# Altium schematic sheet DIFF_DELAY_FANOUT.SchDoc: SPEC-A7
size 420 x 297 mm; Author: G.Kasprowicz; CompanyName: WUT ISE; DrawnBy: G.Kasprowicz; Organization: WUT ISE; Address1: PW ISE; Address2: Nowowiejska 15/19 00-665 Warsaw; Address3: gkasprow@gmail.com; Revision: 2; SheetNumber: 11; SheetTotal: 18; ModifiedBy: -; CheckedDate: -; Title2: Delay & outputs; DivGrp: WUT ISE; Designer: G.Kasprowicz; ModifiedDate: -; ProjectName: Sensor Box
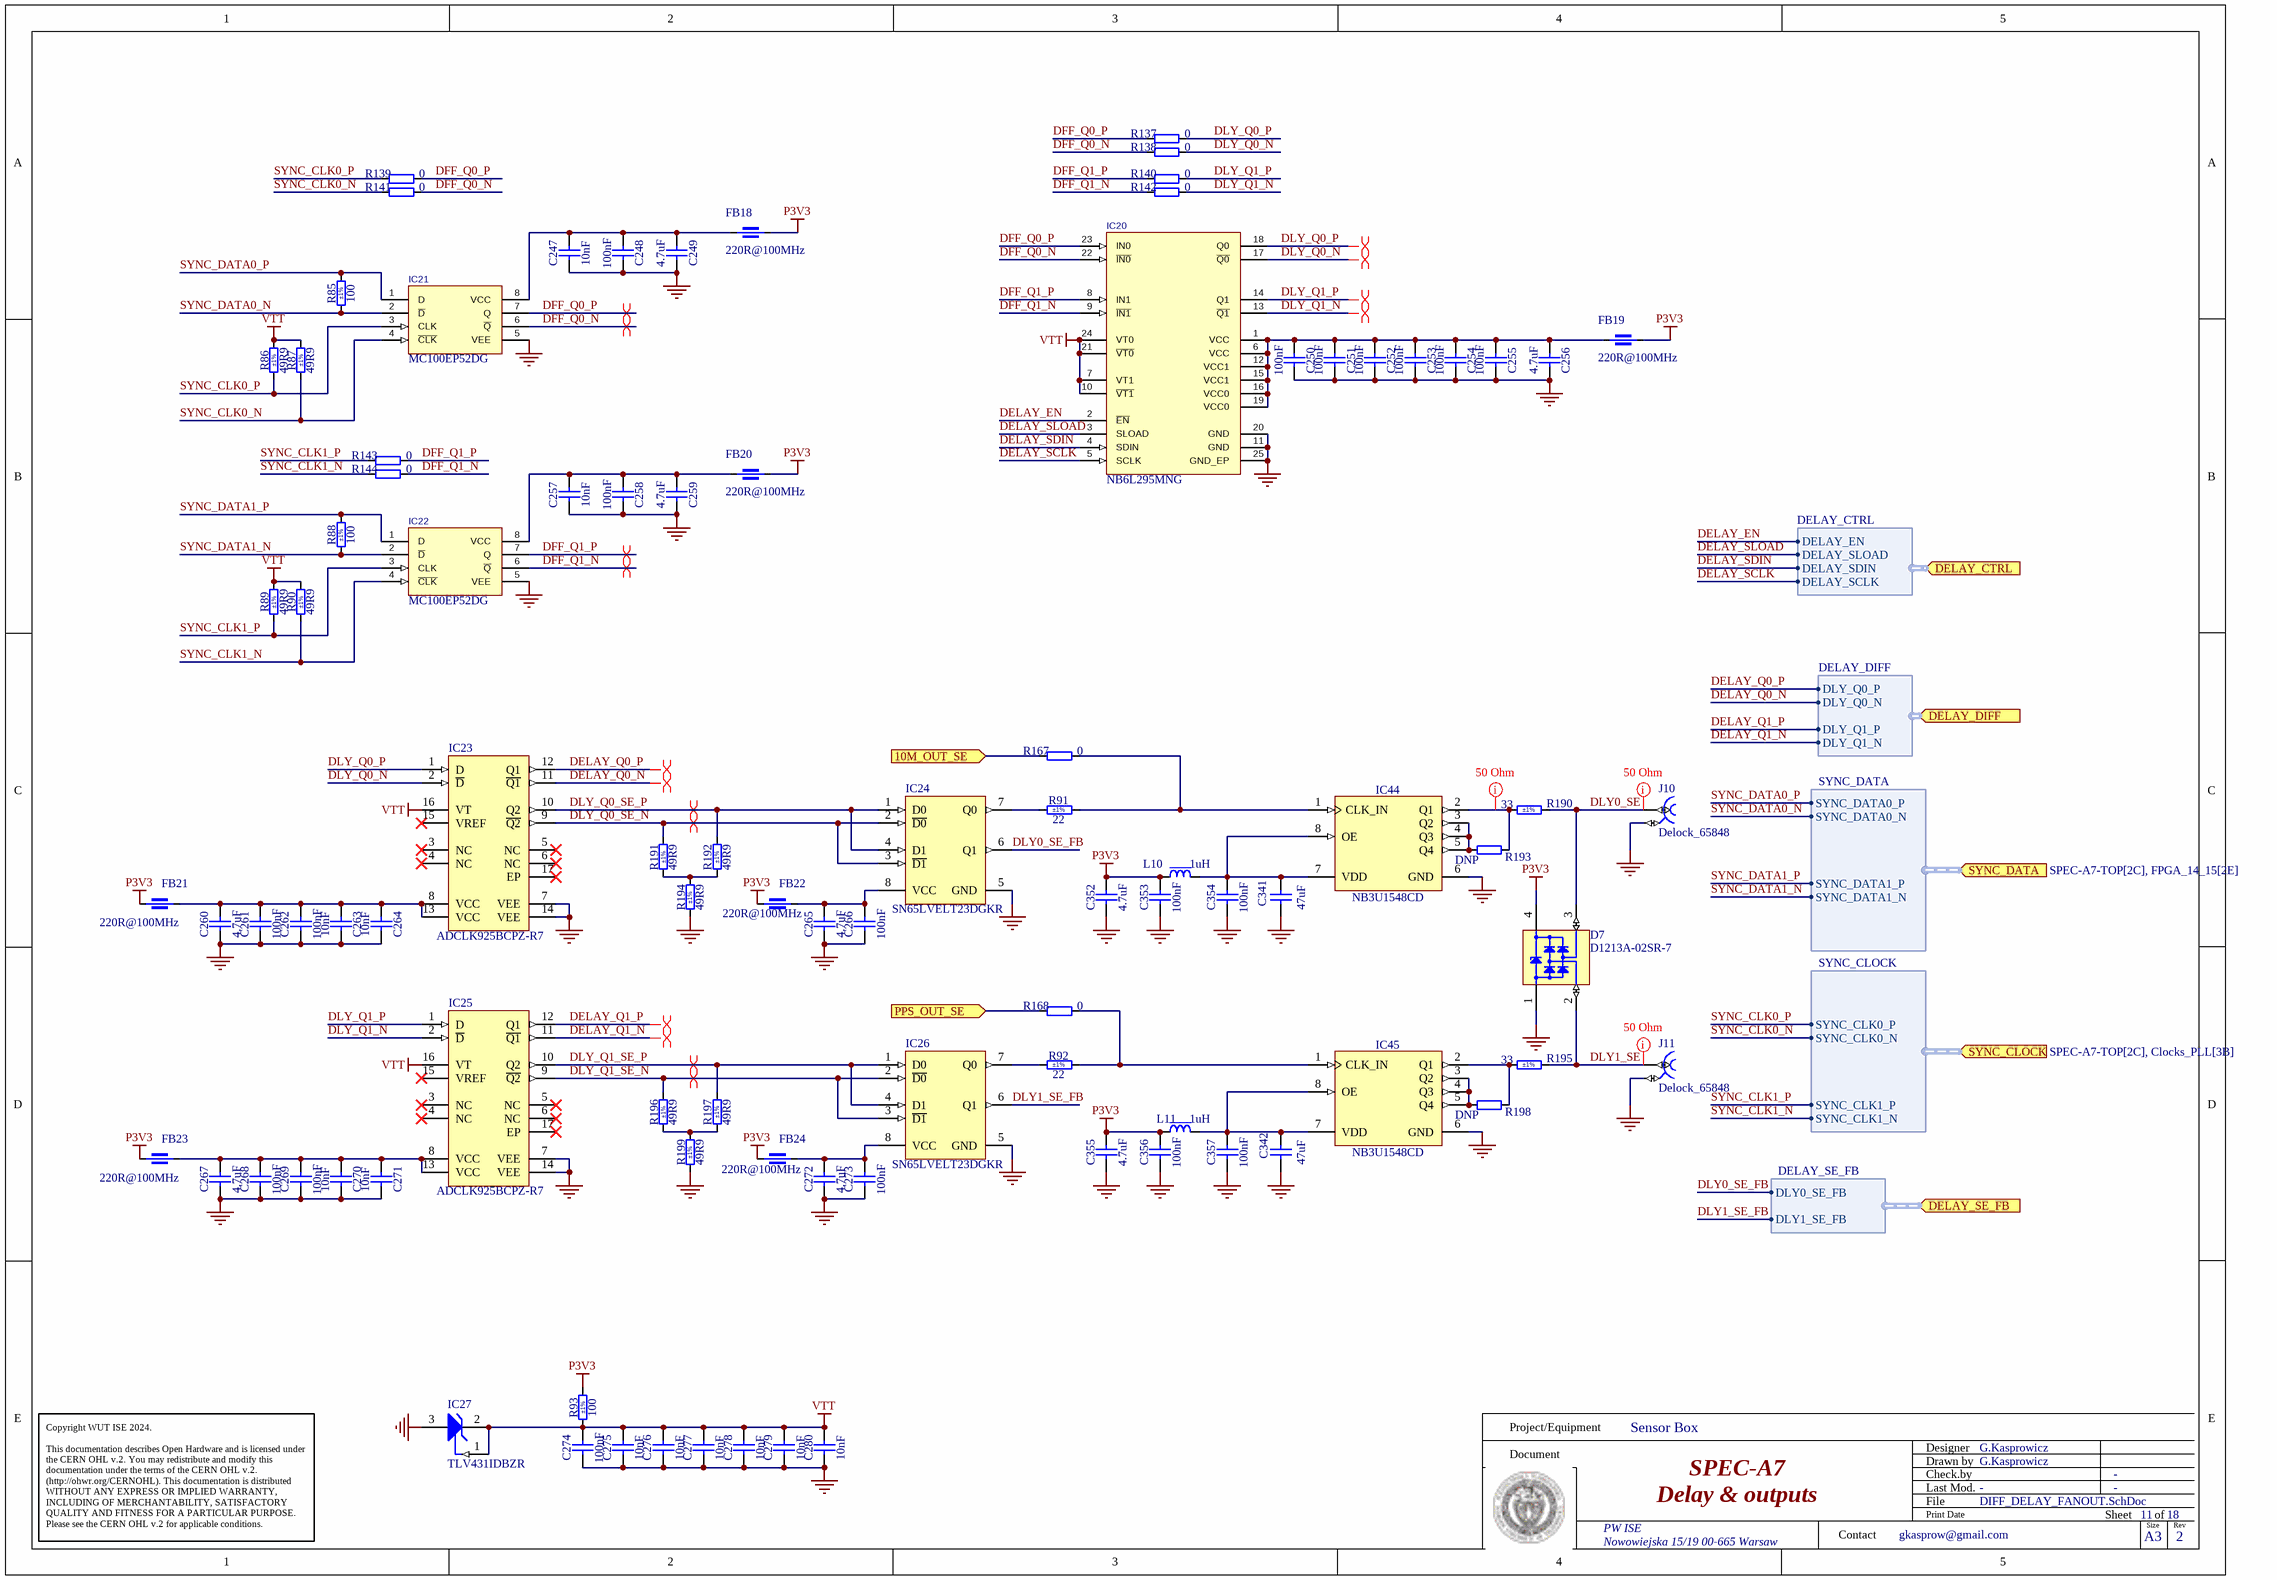
[diagram p0: DIFF_DELAY_FANOUT.SchDoc]

## Parts
C247  10nF  [CAPC1005X55N]
C248  100nF  [CAPC0603X33N]
C249  4.7uF  [CAPC1005X55N]
C250  100nF  [CAPC0603X33N]
C251  100nF  [CAPC0603X33N]
C252  100nF  [CAPC0603X33N]
C253  100nF  [CAPC0603X33N]
C254  100nF  [CAPC0603X33N]
C255  100nF  [CAPC0603X33N]
C256  4.7uF  [CAPC1005X55N]
C257  10nF  [CAPC1005X55N]
C258  100nF  [CAPC0603X33N]
C259  4.7uF  [CAPC1005X55N]
C260  4.7uF  [CAPC1005X55N]
C261  100nF  [CAPC0603X33N]
C262  100nF  [CAPC0603X33N]
C263  10nF  [CAPC1005X55N]
C264  10nF  [CAPC1005X55N]
C265  4.7uF  [CAPC1005X55N]
C266  100nF  [CAPC0603X33N]
C267  4.7uF  [CAPC1005X55N]
C268  100nF  [CAPC0603X33N]
C269  100nF  [CAPC0603X33N]
C270  10nF  [CAPC1005X55N]
C271  10nF  [CAPC1005X55N]
C272  4.7uF  [CAPC1005X55N]
C273  100nF  [CAPC0603X33N]
C274  100nF  [CAPC0603X33N]
C275  10nF  [CAPC1005X55N]
C276  10nF  [CAPC1005X55N]
C277  10nF  [CAPC1005X55N]
C278  10nF  [CAPC1005X55N]
C279  10nF  [CAPC1005X55N]
C280  10nF  [CAPC1005X55N]
C341  47uF  [CAPC1608X100N]
C342  47uF  [CAPC1608X100N]
C352  4.7uF  [CAPC1005X55N]
C353  100nF  [CAPC0603X33N]
C354  100nF  [CAPC0603X33N]
C355  4.7uF  [CAPC1005X55N]
C356  100nF  [CAPC0603X33N]
C357  100nF  [CAPC0603X33N]
D7  D1213A-02SR-7  [SOT190P238X100-4N]
FB18  220R@100MHz  [INDC1608X95N]
FB19  220R@100MHz  [INDC1608X95N]
FB20  220R@100MHz  [INDC1608X95N]
FB21  220R@100MHz  [INDC1608X95N]
FB22  220R@100MHz  [INDC1608X95N]
FB23  220R@100MHz  [INDC1608X95N]
FB24  220R@100MHz  [INDC1608X95N]
IC20  NB6L295MNG  [QFN50P400X400X80-25N-S280]
IC21  MC100EP52DG  [SOIC127P600X175-8N]
IC22  MC100EP52DG  [SOIC127P600X175-8N]
IC23  ADCLK925BCPZ-R7  [ADI-CP-16-3_L]
IC24  SN65LVELT23DGKR  [DGK0008A_L]
IC25  ADCLK925BCPZ-R7  [ADI-CP-16-3_L]
IC26  SN65LVELT23DGKR  [DGK0008A_L]
IC27  TLV431IDBZR  [DBZ0003A_N]
IC44  NB3U1548CD  [SOIC127P600X175-8N]
IC45  NB3U1548CD  [SOIC127P600X175-8N]
J10  Delock_65848  [Delock_65848]
J11  Delock_65848  [Delock_65848]
L10  1uH  [IND_MURATA_LQH32C]
L11  1uH  [IND_MURATA_LQH32C]
R85  100  Tolerance: ±1%  [RESC1005X40N]
R86  49R9  Tolerance: ±1%  [RESC1005X40N]
R87  49R9  Tolerance: ±1%  [RESC1005X40N]
R88  100  Tolerance: ±1%  [RESC1005X40N]
R89  49R9  Tolerance: ±1%  [RESC1005X40N]
R90  49R9  Tolerance: ±1%  [RESC1005X40N]
R91  22  Tolerance: ±1%  [RESC1005X40N]
R92  22  Tolerance: ±1%  [RESC1005X40N]
R93  100  Tolerance: ±1%  [RESC1005X40N]
R137  0  [RESC1005X40N]  (no BOM)
R138  0  [RESC1005X40N]  (no BOM)
R139  0  [RESC1005X40N]  (no BOM)
R140  0  [RESC1005X40N]  (no BOM)
R141  0  [RESC1005X40N]  (no BOM)
R142  0  [RESC1005X40N]  (no BOM)
R143  0  [RESC1005X40N]  (no BOM)
R144  0  [RESC1005X40N]  (no BOM)
R167  0  [RESC1005X40N]  (no BOM)
R168  0  [RESC1005X40N]  (no BOM)
R190  33  Tolerance: ±1%  [RESC2012X60N]
R191  49R9  Tolerance: ±1%  [RESC1005X40N]
R192  49R9  Tolerance: ±1%  [RESC1005X40N]
R193  DNP  [RESC1005X40N]  (no BOM)
R194  49R9  Tolerance: ±1%  [RESC1005X40N]
R195  33  Tolerance: ±1%  [RESC2012X60N]
R196  49R9  Tolerance: ±1%  [RESC1005X40N]
R197  49R9  Tolerance: ±1%  [RESC1005X40N]
R198  DNP  [RESC1005X40N]  (no BOM)
R199  49R9  Tolerance: ±1%  [RESC1005X40N]

## Ports
10M_OUT_SE (in, see SPEC-A7-TOP[2C], FPGA_34[2C]), DELAY_CTRL (in, harness DELAY_CTRL, see SPEC-A7-TOP[2C], FPGA_14_15[1D]), DELAY_DIFF (in, harness DELAY_DIFF, see SPEC-A7-TOP[2C], Ext_connectors[2C]), DELAY_SE_FB (in, harness DELAY_SE_FB, see SPEC-A7-TOP[2C], FPGA_14_15[2E]), PPS_OUT_SE (in, see SPEC-A7-TOP[2C], FPGA_34[2C]), SYNC_CLOCK (in, harness SYNC_CLOCK, see SPEC-A7-TOP[2C], Clocks_PLL[3B]), SYNC_DATA (in, harness SYNC_DATA, see SPEC-A7-TOP[2C], FPGA_14_15[2E])

## Harnesses
SYNC_DATA: SYNC_DATA0_P, SYNC_DATA0_N, SYNC_DATA1_P, SYNC_DATA1_N
DELAY_DIFF: DLY_Q0_P, DLY_Q0_N, DLY_Q1_P, DLY_Q1_N
DELAY_CTRL: DELAY_EN, DELAY_SLOAD, DELAY_SDIN, DELAY_SCLK
DELAY_SE_FB: DLY0_SE_FB, DLY1_SE_FB
SYNC_CLOCK: SYNC_CLK0_P, SYNC_CLK0_N, SYNC_CLK1_P, SYNC_CLK1_N

## Nets
GND: C247.1 C248.1 C249.1 C250.1 C251.1 C252.1 C253.1 C254.1 C255.1 C256.1 C257.1 C258.1 C259.1 C260.1 C261.1 C262.1 C263.1 C264.1 C265.1 C266.1 C267.1 C268.1 C269.1 C270.1 C271.1 C272.1 C273.1 C274.1 C275.1 C276.1 C277.1 C278.1 C279.1 C280.1 C341.1 C342.1 C352.1 C353.1 C354.1 C355.1 C356.1 C357.1 D7.1(GND) IC20.11(GND) IC20.20(GND) IC20.25(GND_EP) IC21.5(VEE) IC22.5(VEE) IC23.7(VEE) IC23.14(VEE) IC24.5(GND) IC25.7(VEE) IC25.14(VEE) IC26.5(GND) IC27.3(ANODE) IC44.6(GND) IC45.6(GND) J10.2 J11.2 R194.1 R199.1
P3V3: C352.2 C353.2 C355.2 C356.2 D7.4(VCC) FB18.1 FB19.1 FB20.1 FB21.1 FB22.1 FB23.1 FB24.1 L10.1 L11.1 R93.2
VTT: C274.2 C275.2 C276.2 C277.2 C278.2 C279.2 C280.2 IC20.7(VT1) IC20.10(~{VT1}) IC20.21(~{VT0}) IC20.24(VT0) IC23.16(VT) IC25.16(VT) IC27.1(REF) IC27.2(CATHODE) R86.2 R87.2 R89.2 R90.2 R93.1
10M_OUT_SE: R167.1 ; port 10M_OUT_SE
DELAY_EN: IC20.2(~{EN}) ; port DELAY_CTRL.DELAY_EN
DELAY_Q0_N: IC23.11(~{Q1}) ; port DELAY_DIFF.DLY_Q0_N
DELAY_Q0_P: IC23.12(Q1) ; port DELAY_DIFF.DLY_Q0_P
DELAY_Q1_N: IC25.11(~{Q1}) ; port DELAY_DIFF.DLY_Q1_N
DELAY_Q1_P: IC25.12(Q1) ; port DELAY_DIFF.DLY_Q1_P
DELAY_SCLK: IC20.5(SCLK) ; port DELAY_CTRL.DELAY_SCLK
DELAY_SDIN: IC20.4(SDIN) ; port DELAY_CTRL.DELAY_SDIN
DELAY_SLOAD: IC20.3(SLOAD) ; port DELAY_CTRL.DELAY_SLOAD
DFF_Q0_N: IC20.22(~{IN0}) IC21.6(~{Q}) R138.1 R141.2
DFF_Q0_P: IC20.23(IN0) IC21.7(Q) R137.1 R139.2
DFF_Q1_N: IC20.9(~{IN1}) IC22.6(~{Q}) R142.1 R144.2
DFF_Q1_P: IC20.8(IN1) IC22.7(Q) R140.1 R143.2
DLY0_SE: D7.3(I/O2) J10.1 R190.1
DLY0_SE_FB: IC24.6(Q1) ; port DELAY_SE_FB.DLY0_SE_FB
DLY1_SE: D7.2(I/O1) J11.1 R195.1
DLY1_SE_FB: IC26.6(Q1) ; port DELAY_SE_FB.DLY1_SE_FB
DLY_Q0_N: IC20.17(~{Q0}) IC23.2(~{D}) R138.2
DLY_Q0_P: IC20.18(Q0) IC23.1(D) R137.2
DLY_Q0_SE_N: IC23.9(~{Q2}) IC24.2(~{D0}) IC24.3(~{D1}) R191.2
DLY_Q0_SE_P: IC23.10(Q2) IC24.1(D0) IC24.4(D1) R192.2
DLY_Q1_N: IC20.13(~{Q1}) IC25.2(~{D}) R142.2
DLY_Q1_P: IC20.14(Q1) IC25.1(D) R140.2
DLY_Q1_SE_N: IC25.9(~{Q2}) IC26.2(~{D0}) IC26.3(~{D1}) R196.2
DLY_Q1_SE_P: IC25.10(Q2) IC26.1(D0) IC26.4(D1) R197.2
PPS_OUT_SE: R168.1 ; port PPS_OUT_SE
SYNC_CLK0_N: IC21.4(~{CLK}) R87.1 R141.1 ; port SYNC_CLOCK.SYNC_CLK0_N
SYNC_CLK0_P: IC21.3(CLK) R86.1 R139.1 ; port SYNC_CLOCK.SYNC_CLK0_P
SYNC_CLK1_N: IC22.4(~{CLK}) R90.1 R144.1 ; port SYNC_CLOCK.SYNC_CLK1_N
SYNC_CLK1_P: IC22.3(CLK) R89.1 R143.1 ; port SYNC_CLOCK.SYNC_CLK1_P
SYNC_DATA0_N: IC21.2(~{D}) R85.1 ; port SYNC_DATA.SYNC_DATA0_N
SYNC_DATA0_P: IC21.1(D) R85.2 ; port SYNC_DATA.SYNC_DATA0_P
SYNC_DATA1_N: IC22.2(~{D}) R88.1 ; port SYNC_DATA.SYNC_DATA1_N
SYNC_DATA1_P: IC22.1(D) R88.2 ; port SYNC_DATA.SYNC_DATA1_P
NetC247_2: C247.2 C248.2 C249.2 FB18.2 IC21.8(VCC)
NetC250_2: C250.2 C251.2 C252.2 C253.2 C254.2 C255.2 C256.2 FB19.2 IC20.1(VCC) IC20.6(VCC) IC20.12(VCC1) IC20.15(VCC1) IC20.16(VCC0) IC20.19(VCC0)
NetC257_2: C257.2 C258.2 C259.2 FB20.2 IC22.8(VCC)
NetC260_2: C260.2 C261.2 C262.2 C263.2 C264.2 FB21.2 IC23.8(VCC) IC23.13(VCC)
NetC265_2: C265.2 C266.2 FB22.2 IC24.8(VCC)
NetC267_2: C267.2 C268.2 C269.2 C270.2 C271.2 FB23.2 IC25.8(VCC) IC25.13(VCC)
NetC272_2: C272.2 C273.2 FB24.2 IC26.8(VCC)
NetC341_2: C341.2 C354.2 IC44.7(VDD) IC44.8(OE) L10.2
NetC342_2: C342.2 C357.2 IC45.7(VDD) IC45.8(OE) L11.2
NetIC24_7: IC24.7(Q0) R91.1
NetIC26_7: IC26.7(Q0) R92.1
NetIC44_1: IC44.1(CLK_IN) R91.2 R167.2
NetIC44_2: IC44.2(Q1) R190.2 R193.1
NetIC44_3: IC44.3(Q2) IC44.4(Q3) IC44.5(Q4) R193.2
NetIC45_1: IC45.1(CLK_IN) R92.2 R168.2
NetIC45_2: IC45.2(Q1) R195.2 R198.1
NetIC45_3: IC45.3(Q2) IC45.4(Q3) IC45.5(Q4) R198.2
NetR191_1: R191.1 R192.1 R194.2
NetR196_1: R196.1 R197.1 R199.2

Not connected (* = marked no-connect by the designer): IC23 3(NC)* 4(NC)* 5(NC)* 6(NC)* 15(VREF)* 17(EP)*; IC25 3(NC)* 4(NC)* 5(NC)* 6(NC)* 15(VREF)* 17(EP)*

## Layout directives
differential pair: DELAY_Q0_N, DELAY_Q0_P, DELAY_Q1_N, DELAY_Q1_P, DFF_Q0_N, DFF_Q0_P, DFF_Q1_N, DFF_Q1_P, DLY_Q0_N, DLY_Q0_P, DLY_Q0_SE_N, DLY_Q0_SE_P, DLY_Q1_N, DLY_Q1_P, DLY_Q1_SE_N, DLY_Q1_SE_P
net class 50_Ohm: DLY0_SE, DLY1_SE, NetIC44_2

## Notes on the sheet
- Project/Equipment
- Document
- Designer
- Drawn by
- Check.by
- Copyright WUT ISE 2024.
  This documentation describes Open Hardware and is licensed under the CERN OHL v.2. You may redistribute and modify this documentation under the terms of the CERN OHL v.2. (http://ohwr.org/CERNOHL). This documentation is distributed WITHOUT ANY EXPRESS OR IMPLIED WARRANTY, INCLUDING OF MERCHANTABILITY, SATISFACTORY QUALITY AND FITNESS FOR A PARTICULAR PURPOSE. Please see the CERN OHL v.2 for applicable conditions.
- Contact
- File
- Last Mod.
- Print Date
- Sheet
- Size
- A3
- of
- Rev

## Library data of the parts
C247 C257 C263 C264 C270 C271 C275-C280 = CC0402_10NF_16V_10%_X7R: Non-polarised capacitor; Part Description: SMD Multilayer Chip Ceramic Capacitor; Manufacturer: GENERIC; Manufacturer1 Part Number: 223878715636; Voltage: 16V; TC: X7R; Tolerance: ±10%; Part Number: CC0402_10NF_16V_10%_X7R; Component Kind: Standard; Component Type: Standard; Pin Count: 2; Value: 10nF; Status: Not Recommended; Manufacturer Part Number: CC0402_10NF_16V_10%_X7R; Case: 0402; Mounted: Yes; Socket: No; SMD: Yes; Sense: No; Manufacturer1 Example: PHYCOMP; Manufacturer1 ComponentHeight: 0.55mm; HelpURL: \\cern.ch\dfs\Applications\Altium\Datasheets\CC0402_X7R_PHYCOMP.pdf; Author: CERN DEM JLC; CreateDate: 03.12.2007; LatestRevisionDate: 03.12.2007
C248 C250-C255 C258 C261 C262 C266 C268 C269 C273 C274 C353 C354 C356 C357 = CC0201_100NF_6.3V_10%_X5R: Non-polarised capacitor; Part Description: SMD Multilayer Chip Ceramic Capacitor; Manufacturer: GENERIC; Manufacturer1 Part Number: 02016D104KAT2A; Voltage: 6.3V; TC: X5R; Tolerance: ±10%; Part Number: CC0201_100NF_6.3V_10%_X5R; Component Kind: Standard; Component Type: Standard; Pin Count: 2; Value: 100nF; Status: Not Recommended; Manufacturer Part Number: CC0201_100NF_6.3V_10%_X5R; Case: 0201; Mounted: Yes; Socket: No; SMD: Yes; Sense: No; Manufacturer1 Example: AVX; Manufacturer1 ComponentHeight: 0.33mm; HelpURL: \\cern.ch\dfs\Applications\Altium\Datasheets\CC0201_X5R_AVX.pdf; Author: CERN DEM JLC; CreateDate: 03.12.2007; LatestRevisionDate: 03.12.2007
C249 C256 C259 C260 C265 C267 C272 C352 C355 = CC0402_4.7UF_6.3V_20%_X5R: Non-polarised capacitor; Part Description: SMD Multilayer Chip Ceramic Capacitor; Manufacturer: GENERIC; Manufacturer1 Part Number: C1005X5R0J475M050BC; Voltage: 6.3V; TC: X5R; Tolerance: ±20%; Part Number: CC0402_4.7UF_6.3V_20%_X5R; Component Kind: Standard; Component Type: Standard; Pin Count: 2; Value: 4.7uF; Status: Preferred; Manufacturer Part Number: CC0402_4.7UF_6.3V_20%_X5R; Case: 0402; Mounted: Yes; Socket: No; SMD: Yes; Sense: No; Manufacturer1 Example: TDK; Manufacturer1 ComponentHeight: 0.65mm; HelpURL: \\cern.ch\dfs\Applications\Altium\Datasheets\CC0402_X5R_TDK_C.pdf; Author: CERN DEM JLC; CreateDate: 03.03.2015; LatestRevisionDate: 03.03.2015
C341 C342 = CC0603_47UF_6.3V_20%_X5R: Non-polarised capacitor; Part Description: SMD Multilayer Chip Ceramic Capacitor; Manufacturer: GENERIC; Manufacturer1 Part Number: GRM188R60J476ME15D; Voltage: 6.3V; TC: X5R; Tolerance: ±20%; Part Number: CC0603_47UF_6.3V_20%_X5R; Component Kind: Standard; Component Type: Standard; Pin Count: 2; Value: 47uF; Status: None; Manufacturer Part Number: CC0603_47UF_6.3V_20%_X5R; Case: 0603; Mounted: Yes; Socket: No; SMD: Yes; Sense: No; Manufacturer1 Example: MURATA; Manufacturer1 ComponentHeight: 1mm; HelpURL: \\cern.ch\dfs\Applications\Altium\Datasheets\CC0603_MURATA_GRM188R60J476ME15D.pdf; Author: CERN DEM JLC; CreateDate: 01.02.2018; LatestRevisionDate: 01.02.2018
D7 = CMP-004-00039-1: D1213A-02SR Series 400 mW Uni-Directional Surface Mount TVS Diode - SOT-143; Mounting Technology: Surface Mount; Case/Package: SOT-143; Max Operating Temperature: 150°C; Pins: 4; Min Operating Temperature: -65°C
FB18-FB24 = IND0603_MURATA_BLM18SG221TN1: Part Description: SMD EMIFIL Suppression Chip Ferrite Bead; Manufacturer: MURATA; Tolerance: ±25%; Power: 2.5A; Resistance: 0.04R; Part Number: IND0603_MURATA_BLM18SG221TN1; Component Kind: Standard; Component Type: Standard; Pin Count: 2; Value: 220R@100MHz; Manufacturer Part Number: BLM18SG221TN1; Case: 0603; Mounted: Yes; Socket: No; SMD: Yes; Sense: No; ComponentHeight: 0.95mm; HelpURL: \\cern.ch\dfs\Applications\Altium\Datasheets\IND0603_MURATA_BLM18S.pdf; Author: CERN DEM MR; CreateDate: 08.01.2016; LatestRevisionDate: 25.10.2018
IC20 = NB6L295MNG: Manufacturer_Name: onsemi; Reference: IC?; Footprint: QFN50P400X400X100-25N; Datasheet: http://www.onsemi.com/pub/Collateral/NB6L295-D.PDF; Height: 1; Mouser Part Number: 863-NB6L295MNG; Mouser Price/Stock: https://www.mouser.co.uk/ProductDetail/ON-Semiconductor/NB6L295MNG?qs=t2BMfLoP1KTcOfiCXyq1Jw%3D%3D; Manufacturer_Part_Number: NB6L295MNG; Value: NB6L295MNG
IC21 IC22 = MC100EP52DG: Manufacturer_Name: onsemi; Reference: IC; Datasheet: http://www.onsemi.com/pub/Collateral/MC10EP52-D.PDF; Height: 1.75; Mouser Part Number: 863-MC100EP52DG; Mouser Price/Stock: https://www.mouser.co.uk/ProductDetail/onsemi/MC100EP52DG?qs=zorda86t5M%2FLiRmjo16XeQ%3D%3D; Manufacturer_Part_Number: MC100EP52DG; Value: MC100EP52DG
IC23 IC25 = CMP-0288-00092-1: Ultrafast SiGe ECL Clock/Data Buffers, CP-16-3, Pb-Free, 1500 Reel; Inputs: 1; Product Description: Clock Buffer; Outputs: 2; Max f-out (MHz): 6000; +Supply Voltage (V): 3.3; On-Chip VCO or DCO: No; Output Logic: ECL; LVPECL; PECL; ComponentLink1URL: www.analog.com; DatasheetVersion: Rev. 0; Code_JEDEC: MO-220-VEED-2; ComponentLink3Description: Package Specification; PackageDescription: 16-Lead Lead Frame Chip Scale Package [LFCSP_VQ]; ComponentLink3URL: http://www.analog.com/static/imported-files/packages/PKG_PDF/LFCSP(CP)/CP_16_3.pdf; PackageReference: CP-16-3; PackageVersion: Jan-2005; ComponentLink1Description: Manufacturer URL; ComponentLink2URL: http://www.analog.com/static/imported-files/data_sheets/ADCLK905_907_925.pdf; ComponentLink2Description: Datasheet
IC24 IC26 = CMP-0327-00201-3: 600 Mbps 3.3 V Dual Differential LVPECL Buffer to LVTTL Translator, 2 Tx and 2 Rx, -40 to +85 degC, 8-pin VSSOP (DGK), Green (RoHS & no Sb/Br); Manufacturer: Texas Instruments; Part-to-Part Skew(Max)(ps): 200; ICC(Max)(mA): 27; No. of Tx: 2; SubFamily: PECL PHY; xECL: TRUE; Signaling Rate(Mbps): 600; Input Signal: LVPECL, LVDS; ComponentLink3Description: URL Link1; PartNumber: SN65LVELT23DGKR; PackageVersion: revE, May-2006; No. of Rx: 2; ComponentLink1Description: Manufacturer URL; ComponentLink2Description: Datasheet; ComponentLink1URL: http://www.ti.com/; PackageDescription: 8-Pin Thin Small Outline Package 3 x 3 mm Body ,0.65 mm Pitch; DatasheetVersion: SLLS929A; PackageReference: DGK0008A; Eco-Plan: Green (RoHS & no Sb/Br); Output Signal: LVTTL; ComponentLink3URL: SamplesURL:http://www.ti.com/product/sn65lvelt23#samples; ComponentLink2URL: http://www.ti.com/general/docs/lit/getliterature.tsp?genericPartNumber=SN65LVELT23&fileType=pdf; Mounting Technology: Surface Mount
IC27 = CMP-0366-00832-2: Low Voltage Adjustable Precision Shunt Regulator, 39 ppm / degC, 15 mA, -40 to 85 degC, 3-pin SOT-23 (DBZ), Green (RoHS & no Sb/Br); Manufacturer: Texas Instruments; VO Adj(Min)(V): 1.24; Temp Coeff(Typ)(ppm/ degree C): 39; Rating: Catalog; Min Iz for Regulation(uA): 80; VO Adj(Max)(V): 6; Iout/Iz(Max)(mA): 15; Temp Coeff(Max)(ppm/ degree C): 129; SubFamily: Shunt Voltage Reference; Initial Accuracy @ 25/deg C(%): 1.5; Eco-Plan: Green (RoHS & no Sb/Br); PackageDescription: 3-Pin Plastic Small Outline, Body 2.92 x 1.3 mm, Pitch 0.95 mm; PackageReference: DBZ0003A; ComponentLink4Description: URL Link1; ComponentLink3Description: Package Specification; DatasheetVersion: SLVS139T; ComponentLink4URL: Samples URL:http://www.ti.com/product/tlv431; PackageVersion: 4203227/B; ComponentLink3URL: http://www.ti.com/litv/pdf/mpds108a; ComponentLink1URL: http://www.ti.com/; Code_JEDEC: TO-236; ComponentLink2Description: Datasheet; ComponentLink1Description: Manufacturer URL; Mounting Technology: Surface Mount; PartNumber: TLV431IDBZR; ComponentLink2URL: http://www.ti.com/general/docs/lit/getliterature.tsp?genericPartNumber=TLV431&fileType=pdf
IC44 IC45 = NB3U1548CD: 3.3V/2.5V/1.8V/1.5V 160 MHz 1:4 LVCMOS/LVTTL Low Skew Over Voltage Tolerant Fanout Buffer; Manufacturer: ON SEMICONDUCTOR; PressFit: No; Bonding: No; Part Number: NB3U1548CD; Component Kind: Standard; Component Type: Standard; Device: NB3U1548CD; PackageDescription: SOIC 8, Pitch 1.27mm, Body 4x5mm, IPC Medium Density; Part Description: 3.3V/2.5V/1.8V/1.5V 160 MHz 1:4 LVCMOS/LVTTL Low Skew Over Voltage Tolerant Fanout Buffer; Manufacturer Part Number: NB3U1548CD; Pin Count: 8; Case: SOIC8; Mounted: Yes; Socket: No; SMD: Yes; Sense: No; ComponentHeight: 1.75mm; Author: CERN DEM HF; HelpURL: \\cern.ch\dfs\Applications\Altium\Datasheets\NB3U1548C.pdf; CreateDate: 29.11.2024; LatestRevisionDate: 29.11.2024
J10 J11 = CMP-002-04652-1: SMA connector Delock 65848
L10 L11 = IND_1UH_20%_MURATA_LQH32CN1R0M33: Inductor With Core; Part Description: Chip Inductor (Chip Coil) for Choke Wire Wound Type; Manufacturer: MURATA; Power: 1A; Resistance: 0.06R; Tolerance: ±20%; Part Number: IND_1UH_20%_MURATA_LQH32CN1R0M33; Component Kind: Standard; Component Type: Standard; Pin Count: 2; Value: 1uH; Manufacturer Part Number: LQH32CN1R0M33; Mounted: Yes; Socket: No; SMD: Yes; Sense: No; ComponentHeight: 2.2mm; HelpURL: \\cern.ch\dfs\Applications\Altium\Datasheets\IND_MURATA_LQH32CN_33.pdf; Author: CERN DEM JLC; CreateDate: 14.08.2012; LatestRevisionDate: 04.07.2018
R85 R88 R93 = R0402_100R_1%_0.0625W_100PPM: Resistor - 1%; Part Description: General Purpose Thick Film Chip Resistor; Manufacturer: GENERIC; Manufacturer1 Part Number: 232270671001L; TC: ±100ppm/°C; PressFit: No; Part Number: R0402_100R_1%_0.0625W_100PPM; Component Kind: Standard; Component Type: Standard; Pin Count: 2; Value: 100; Status: Not Recommended; Power: 0.0625W; Manufacturer Part Number: R0402_100R_1%_0.0625W_100PPM; Case: 0402; Mounted: Yes; Sense: No; Socket: No; SMD: Yes; Manufacturer1 Example: YAGEO PHYCOMP; Manufacturer1 ComponentHeight: 0.4mm; HelpURL: \\cern.ch\dfs\Applications\Altium\Datasheets\R0402_Phycomp_RC0402.pdf; Author: CERN DEM JLC; CreateDate: 03.12.2007; LatestRevisionDate: 17.10.2012
R86 R87 R89 R90 R191 R192 R194 R196 R197 R199 = R0402_49R9_1%_0.0625W_100PPM: Resistor - 1%; Part Description: General Purpose Thick Film Chip Resistor; Manufacturer: GENERIC; Manufacturer1 Part Number: 232270674999L or RC0402FR-0749R9L; TC: ±100ppm/°C; PressFit: No; Part Number: R0402_49R9_1%_0.0625W_100PPM; Component Kind: Standard; Component Type: Standard; Pin Count: 2; Value: 49R9; Status: Not Recommended; Power: 0.0625W; Manufacturer Part Number: R0402_49R9_1%_0.0625W_100PPM; Case: 0402; Mounted: Yes; Sense: No; Socket: No; SMD: Yes; Manufacturer1 Example: YAGEO PHYCOMP; Manufacturer1 ComponentHeight: 0.4mm; HelpURL: \\cern.ch\dfs\Applications\Altium\Datasheets\R0402_Phycomp_RC0402.pdf; Author: CERN DEM JLC; CreateDate: 24.10.2012; LatestRevisionDate: 24.10.2012
R91 R92 = R0402_22R_1%_0.0625W_100PPM: Resistor - 1%; Part Description: General Purpose Thick Film Chip Resistor; Manufacturer: GENERIC; Manufacturer1 Part Number: 232270672209L; TC: ±100ppm/°C; PressFit: No; Part Number: R0402_22R_1%_0.0625W_100PPM; Component Kind: Standard; Component Type: Standard; Pin Count: 2; Value: 22; Status: Not Recommended; Power: 0.0625W; Manufacturer Part Number: R0402_22R_1%_0.0625W_100PPM; Case: 0402; Mounted: Yes; Sense: No; Socket: No; SMD: Yes; Manufacturer1 Example: YAGEO PHYCOMP; Manufacturer1 ComponentHeight: 0.4mm; HelpURL: \\cern.ch\dfs\Applications\Altium\Datasheets\R0402_Phycomp_RC0402.pdf; Author: CERN DEM JLC; CreateDate: 03.12.2007; LatestRevisionDate: 17.10.2012
R137-R144 R167 R168 R193 R198 = R0402_0R_JUMPER: Resistor; Part Description: 1A (0.05R Max DC Resistance) Zero Ohm Jumper; Manufacturer: GENERIC; Manufacturer1 Part Number: 232270591001L; PressFit: No; Part Number: R0402_0R_JUMPER; Component Type: Standard; Pin Count: 2; Status: Not Recommended; Manufacturer Part Number: R0402_0R_JUMPER; Case: 0402; Mounted: Yes; Sense: No; Socket: No; SMD: Yes; Manufacturer1 Example: YAGEO PHYCOMP; Manufacturer1 ComponentHeight: 0.4mm; HelpURL: \\cern.ch\dfs\Applications\Altium\Datasheets\R0402_Phycomp_RC0402.pdf; Author: CERN DEM JLC; CreateDate: 03.12.2007; LatestRevisionDate: 17.10.2012
  R137-R144 R167 R168: Value: 0
  R193 R198: Value: DNP
R190 R195 = R0805_33R_1%_0.125W_100PPM: Resistor - 1%; Part Description: General Purpose Thick Film Chip Resistor; Manufacturer: GENERIC; Manufacturer1 Part Number: NRC10F33R0TRF; PressFit: No; Power: 0.125W; TC: ±100ppm/°C; Part Number: R0805_33R_1%_0.125W_100PPM; Component Kind: Standard; Component Type: Standard; Pin Count: 2; Value: 33; Status: Preferred; Manufacturer Part Number: R0805_33R_1%_0.125W_100PPM; Case: 0805; Mounted: Yes; Sense: No; Socket: No; SMD: Yes; Manufacturer1 Example: NIC COMPONENT; Manufacturer1 ComponentHeight: 0.6mm; HelpURL: \\cern.ch\dfs\Applications\Altium\Datasheets\R0805_NIC_NRC.pdf; Author: CERN DEM JLC; CreateDate: 03.12.2007; LatestRevisionDate: 13.03.2008